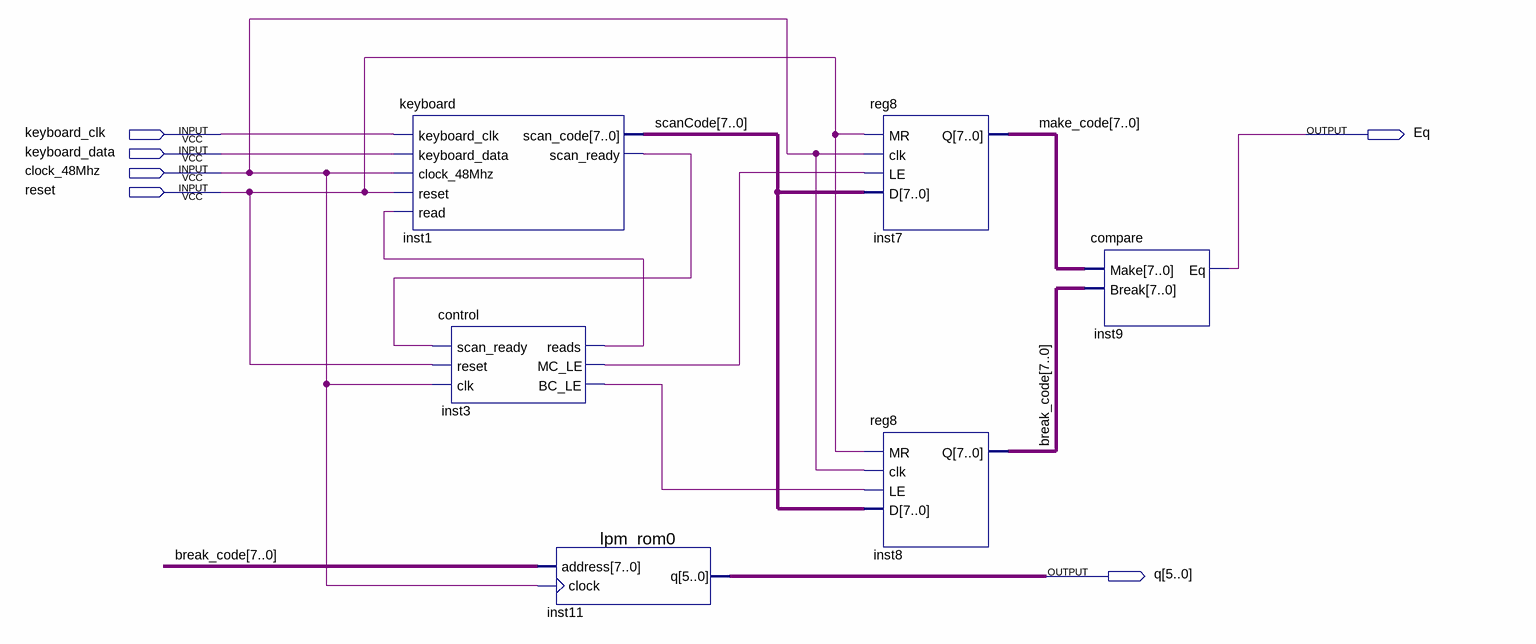
[diagram p0: schematic sheet]
// Quartus schematic keycomp.bdf as structural Verilog: 6 symbols, 6 pins
module keycomp (
  input  keyboard_clk,
  input  keyboard_data,
  input  clock_48Mhz,
  input  reset,
  output Eq,
  output [5:0] q
);

  wire inst1_scan_ready, inst3_bc_le, inst3_mc_le, inst3_reads;
  wire [7:0] break_code, make_code, scanCode;

  keyboard inst1 (
    .keyboard_clk(keyboard_clk), .keyboard_data(keyboard_data), .clock_48Mhz(clock_48Mhz), .reset(reset),
    .read(inst3_reads), .scan_code(scanCode), .scan_ready(inst1_scan_ready));
  control inst3 (
    .scan_ready(inst1_scan_ready), .reset(reset), .clk(clock_48Mhz), .reads(inst3_reads),
    .MC_LE(inst3_mc_le), .BC_LE(inst3_bc_le));
  lpm_rom0 inst11 (.address(break_code), .clock(clock_48Mhz), .q(q));
  reg8 inst7 (.MR(reset), .clk(clock_48Mhz), .LE(inst3_mc_le), .D(scanCode), .Q(make_code));
  reg8 inst8 (.MR(reset), .clk(clock_48Mhz), .LE(inst3_bc_le), .D(scanCode), .Q(break_code));
  compare inst9 (.Make(make_code), .Break(break_code), .Eq(Eq));
endmodule
